# EAGLE design led_board (EAGLE 8.2.2)
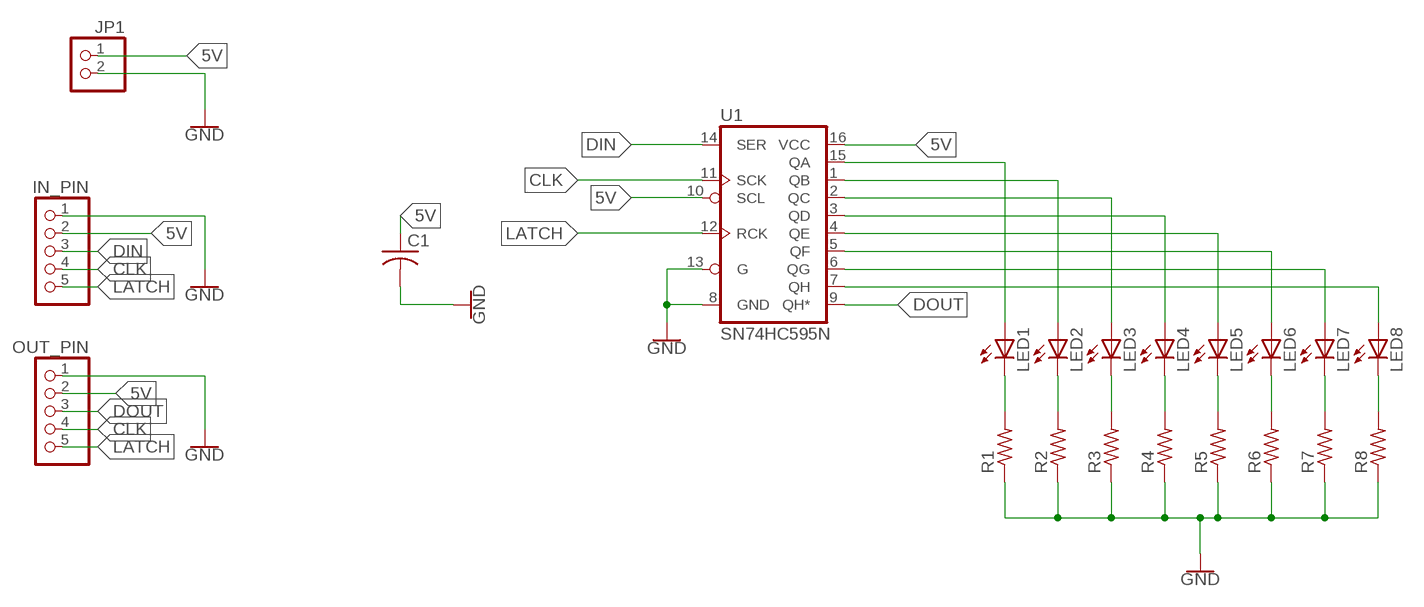
[diagram p0: schematic, sheet 1]

## Parts
C1  C-US025-030X050  [C025-030X050]
IN_PIN  PINHD-1X5  [1X05]
JP1  PINHD-1X2  [1X02]
LED1  LED3MM  [LED3MM]
LED2  LED3MM  [LED3MM]
LED3  LED3MM  [LED3MM]
LED4  LED3MM  [LED3MM]
LED5  LED3MM  [LED3MM]
LED6  LED3MM  [LED3MM]
LED7  LED3MM  [LED3MM]
LED8  LED3MM  [LED3MM]
OUT_PIN  PINHD-1X5  [1X05]
R1  R-US_0207/7  [0207/7]
R2  R-US_0207/7  [0207/7]
R3  R-US_0207/7  [0207/7]
R4  R-US_0207/7  [0207/7]
R5  R-US_0207/7  [0207/7]
R6  R-US_0207/7  [0207/7]
R7  R-US_0207/7  [0207/7]
R8  R-US_0207/7  [0207/7]
U1  SN74HC595N  74HC595N  [DIP16]

## Nets
5V: C1.1 IN_PIN.2 JP1.1 OUT_PIN.2 U1.10(SCL) U1.16(VCC)
CLK: IN_PIN.4 OUT_PIN.4 U1.11(SCK)
DIN: IN_PIN.3 U1.14(SER)
DOUT: OUT_PIN.3 U1.9(QH*)
GND: C1.2 IN_PIN.1 JP1.2 OUT_PIN.1 R1.1 R2.1 R3.1 R4.1 R5.1 R6.1 R7.1 R8.1 U1.8(GND) U1.13(G)
LATCH: IN_PIN.5 OUT_PIN.5 U1.12(RCK)
N$1: LED1.K(C) R1.2
N$2: LED2.K(C) R2.2
N$3: LED3.K(C) R3.2
N$4: LED4.K(C) R4.2
N$5: LED5.K(C) R5.2
N$6: LED6.K(C) R6.2
N$7: LED7.K(C) R7.2
N$8: LED8.K(C) R8.2
N$10: LED1.A U1.15(QA)
N$11: LED2.A U1.1(QB)
N$12: LED3.A U1.2(QC)
N$13: LED4.A U1.3(QD)
N$14: LED5.A U1.4(QE)
N$15: LED6.A U1.5(QF)
N$16: LED7.A U1.6(QG)
N$17: LED8.A U1.7(QH)

## Library data of the parts
C1 = adafruit:C-US: CAPACITOR, American symbol
IN_PIN OUT_PIN = pinhead:PINHD-1X5: PIN HEADER
JP1 = pinhead:PINHD-1X2: PIN HEADER
LED1-LED8 = adafruit:LED: LED OSRAM: - CHIPLED LG R971, LG N971, LY N971, LG Q971, LY Q971, LO R971, LY R971 LH N974, LH R974 LS Q976, LO Q976, LY Q976 LO Q996 - Hyper CHIPLED LW Q18S LB Q993, LB Q99A, LB R99A - SideLED LS A670, LO A670, LY A670, LG A670, LP A670 LB A673, LV A673, LT A673, LW A673 LH A674 LY A675 LS A676, LA A676, LO A676, LY A676, LW A676 LS A679, LY A679, LG A679 - Hyper Micro SIDELED® LS Y876, LA Y876, LO Y876, LY Y876 LT Y87S - SmartLED LW L88C, LW L88S LB L89C, LB L89S, LG L890 LS L89K, LO L89K, LY L89K LS L896, LA L896, LO L896, LY L896 - TOPLED LS T670, LO T670, LY T670, LG T670, LP T670 LSG T670, LSP T670, LSY T670, LOP T670, LYG T670 LG T671, LOG T671, LSG T671 LB T673, LV T673, LT T673, LW T673 LH T674 LS T676, LA T676, LO T676, LY T676, LB T676, LH T676, LSB T676, LW T676 LB T67C, LV T67C, LT T67C, LS T67K, LO T67K, LY T67K, LW E67C LS E67B, LA E67B, LO E67B, LY E67B, LB E67C, LV E67C, LT E67C LW T67C LS T679, LY T679, LG T679 LS T770, LO T770, LY T770, LG T770, LP T770 LB T773, LV T773, LT T773, LW T773 LH T774 LS E675, LA E675, LY E675, LS T675 LS T776, LA T776, LO T776, LY T776, LB T776 LHGB T686 LT T68C, LB T68C - Hyper Mini TOPLED® LB M676 - Mini TOPLED Santana® LG M470 LS M47K, LO M47K, LY M47K Source: http://www.osram.convergy.de/
R1-R8 = adafruit:R-US_: RESISTOR, American symbol
U1 = SparkFun-IC-Logic:74*595: 8-Bit Shift Register (Serial to Parallel) Datasheet <http://cdn.sparkfun.com/datasheets/BreakoutBoards/MM74HC595.pdf> SparkFun Products SparkFun Shift Register Breakout - 74HC595 <https://www.sparkfun.com/products/10680> (BOB-10680); PROD_ID: IC-13123

## Board
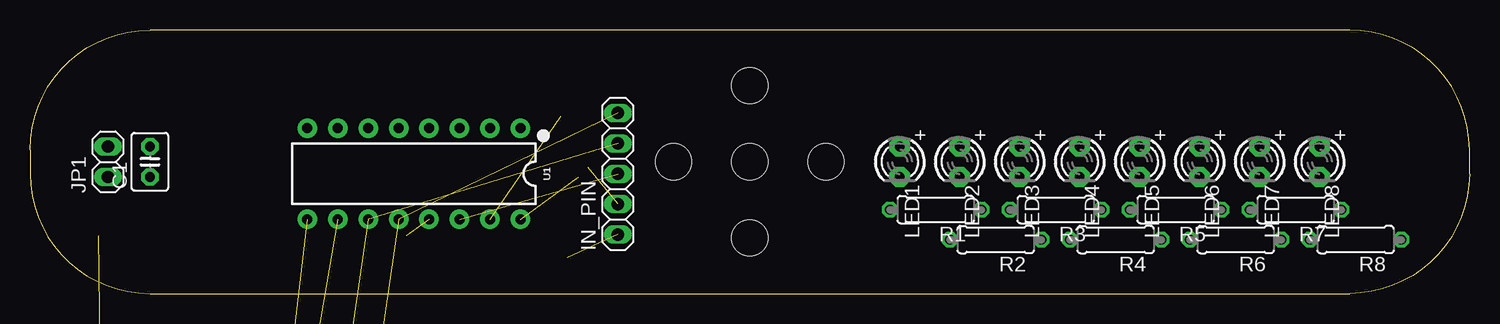
[diagram p1: board, top side]
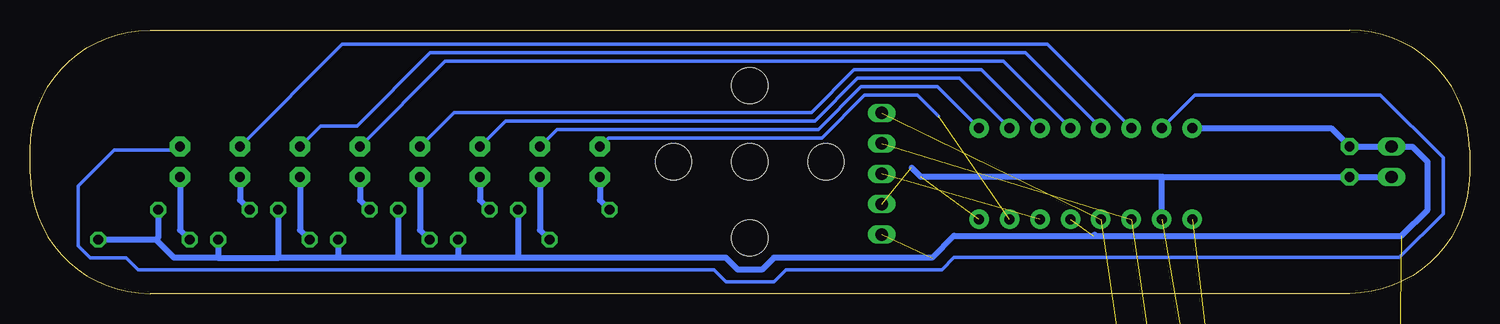
[diagram p2: board, bottom side, seen from below]

Size 120 x 22 mm. Coordinates in mm from the lower left corner, seen from the top.
Outline: 10,0 110,0 arc90 120,10 120,12 arc90 110,22 10,22 arc90 0,12 0,10 arc90 10,0
Copper layers (1*16): Top 0.035mm / dielectric 1.5mm / Bottom 0.035mm
Design rules "OthermillDRC_1_100_v2": minimum track width 8mil, minimum drill 0.8mm, track to track 0.256540625mm, track to pad 0.256540625mm, pad to pad 0.256540625mm, via to via 0.256540625mm, smd to smd 0mil, copper to edge 0mil, drill to drill 1mil, minimum pad ring 10mil, minimum via ring 10mil, stop-mask expansion 1mil, vias tented up to drill 30mil, thermal gap 10mil
Holes 3 mm at 60,11 60,4.65 60,17.35 66.35,11 53.65,11

### Footprints (pad centres in the part's own frame; a part is rotated, then mirrored left to right if it is on the bottom)
C025-030X050 = drill 0.813 pad 1.422 octagon: 1 -1.27,0; 2 1.27,0
1X05 = drill 1.016 long: 1 -5.08,0; 2 -2.54,0; 3 0,0; 4 2.54,0; 5 5.08,0
1X02 = drill 1.016 long: 1 -1.27,0; 2 1.27,0
LED3MM = drill 0.813 pad 1.676 octagon: A -1.27,0; K 1.27,0
0207/7 = drill 0.813 octagon: 1 -3.81,0; 2 3.81,0
DIP16 = drill 0.813 pad 1.626: 1 -8.89,-3.81; 2 -6.35,-3.81; 3 -3.81,-3.81; 4 -1.27,-3.81; 5 1.27,-3.81; 6 3.81,-3.81; 7 6.35,-3.81; 8 8.89,-3.81; 9 8.89,3.81; 10 6.35,3.81; 11 3.81,3.81; 12 1.27,3.81; 13 -1.27,3.81; 14 -3.81,3.81; 15 -6.35,3.81; 16 -8.89,3.81

### Placement (x,y rotation side)
C1  10,11 90 top
IN_PIN  49,10 90 top
JP1  6.5,11 90 top
LED1  72.5,11 270 top
LED2  77.5,11 270 top
LED3  82.5,11 270 top
LED4  87.5,11 270 top
LED5  92.5,11 270 top
LED6  97.5,11 270 top
LED7  102.5,11 270 top
LED8  107.5,11 270 top
OUT_PIN  12,-88 0 top  (outside the outline)
R1  75.5,7 180 top
R2  80.5,4.5 180 top
R3  85.5,7 180 top
R4  90.5,4.5 180 top
R5  95.5,7 180 top
R6  100.5,4.5 180 top
R7  105.5,7 180 top
R8  110.5,4.5 180 top
U1  32,10 180 top

### Tracks (layer width: path | path; a pad name or v marks a point on that pad's centre or on a via)
5V  (3 unrouted)
  Bottom 0.508: JP1.1 C1.1 25.59,9.73 | 25.59,9.73 31.25,9.73 | 31.25,9.73 45.73,9.73 46.51,10.51 | 31.27,9.75 31.25,9.73 | U1.10 25.65,9.67 25.59,9.73
CLK  (2 unrouted)
DIN  (1 unrouted)
DOUT  (1 unrouted)
GND  (3 unrouted)
  Bottom 0.508: 31.37,4.82 42.97,4.82 44.79,3 58,3 59,2 61,2 62,3 79.15,3 | 31.37,4.82 5.68,4.82 3.5,7 3.5,11 4.77,12.27 JP1.2 C1.2 11.54,13.81 U1.8 | 31.27,4.92 31.37,4.82 | 104.34,3 99.28,3 | 104.34,3 108,3 109.5,4.5 | 94.34,3 99.28,3 | 89.29,3 94.34,3 | 84.18,3 89.29,3 | 79.15,3 84.18,3 | 109.5,4.5 R8.1 | R7.1 109.31,4.69 109.5,4.5 | R5.1 99.31,3.03 99.28,3 | R4.1 94.31,3.03 94.34,3 | R3.1 89.31,3.02 89.29,3 | R2.1 84.31,3.13 84.18,3 | R1.1 79.31,3.16 79.15,3 | R6.1 104.31,3.03 104.34,3
LATCH  (2 unrouted)
N$1
  Bottom 0.508: LED1.K 72.5,7.81 R1.2
N$2
  Bottom 0.508: LED2.K 77.5,5.31 R2.2
N$3
  Bottom 0.508: LED3.K 82.5,7.81 R3.2
N$4
  Bottom 0.508: LED4.K 87.5,5.31 R4.2
N$5
  Bottom 0.508: LED5.K 92.5,7.81 R5.2
N$6
  Bottom 0.508: LED6.K 97.5,5.31 R6.2
N$7
  Bottom 0.508: LED7.K 102.5,7.81 R7.2
N$8
  Bottom 0.508: LED8.K 107.5,5.31 R8.2
N$10  (1 unrouted)
  Bottom 0.305: 44.26,14.81 46.03,16.58 50.42,16.58 54,13 71.77,13 LED1.A
N$11
  Bottom 0.305: LED2.A 76.07,13.7 54.29,13.7 50.71,17.28 44.36,17.28 U1.1
N$12
  Bottom 0.305: LED3.A 80.36,14.41 54.58,14.41 51,17.99 42.53,17.99 U1.2
N$13
  Bottom 0.305: LED4.A 84.66,15.11 54.87,15.11 51.29,18.69 40.69,18.69 U1.3
N$14
  Bottom 0.305: LED5.A 85.38,19.39 38.85,19.39 U1.4
N$15
  Bottom 0.305: LED6.A 95.77,14 92.73,14 86.64,20.1 37.02,20.1 U1.5
N$16
  Bottom 0.305: LED7.A 93.97,20.8 35.18,20.8 U1.6
N$17
  Bottom 0.305: LED8.A 107.77,12 113,12 116,9 116,4 115,3 112,3 111,2 63,2 62,1 58,1 57,2 44,2 42.98,3.02 5.84,3.02 2.19,6.67 2.19,11.33 7.44,16.58 22.88,16.58 U1.7